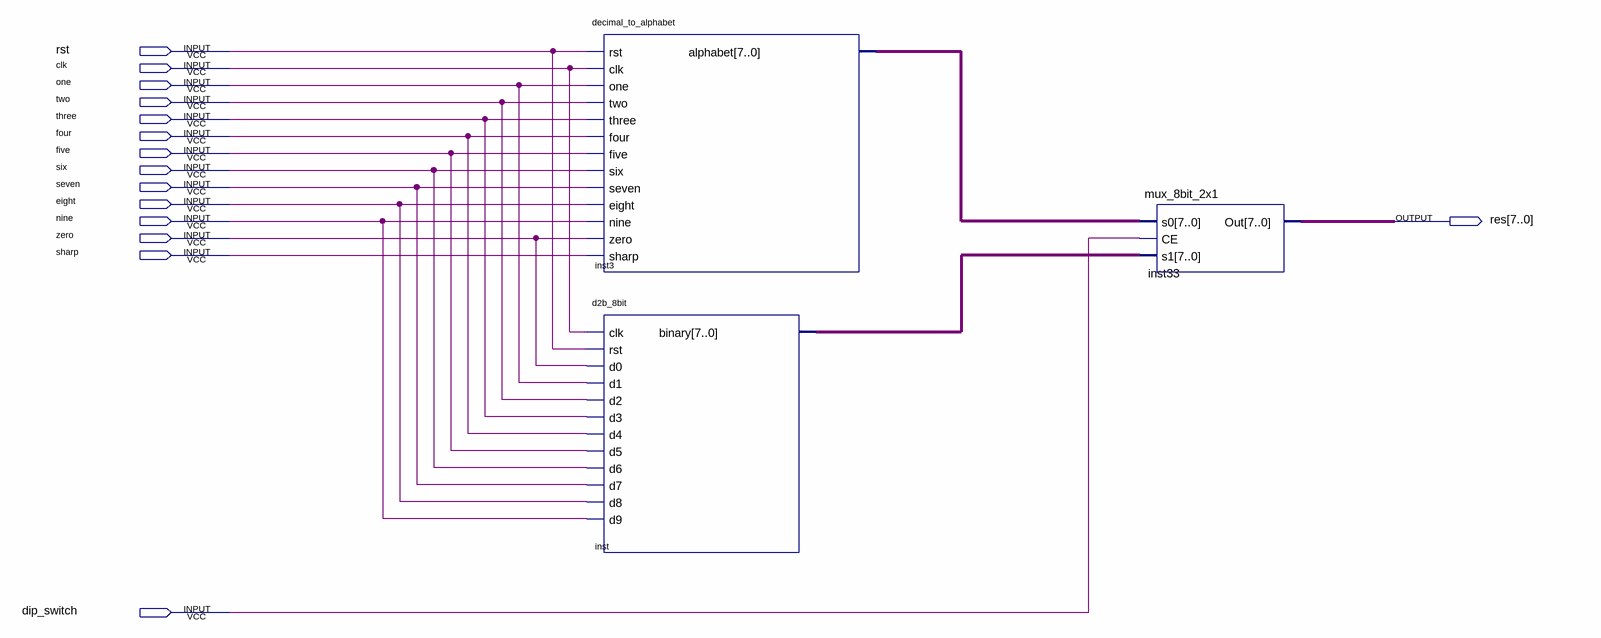
[diagram p0: schematic sheet]
// Quartus schematic INPUT_MODULE.bdf as structural Verilog: 3 symbols, 15 pins
module INPUT_MODULE (
  input  rst,
  input  clk,
  input  one,
  input  two,
  input  three,
  input  four,
  input  five,
  input  six,
  input  seven,
  input  eight,
  input  nine,
  input  zero,
  input  sharp,
  input  dip_switch,
  output [7:0] res
);

  wire [7:0] inst3_alphabet, inst_binary;

  decimal_to_alphabet inst3 (
    .rst(rst), .clk(clk), .one(one), .two(two), .three(three), .four(four), .five(five), .six(six),
    .seven(seven), .eight(eight), .nine(nine), .zero(zero), .sharp(sharp), .alphabet(inst3_alphabet));
  d2b_8bit inst (
    .clk(clk), .rst(rst), .d0(zero), .d1(one), .d2(two), .d3(three), .d4(four), .d5(five), .d6(six),
    .d7(seven), .d8(eight), .d9(nine), .binary(inst_binary));
  mux_8bit_2x1 inst33 (.s0(inst3_alphabet), .CE(dip_switch), .s1(inst_binary), .Out(res));
endmodule
